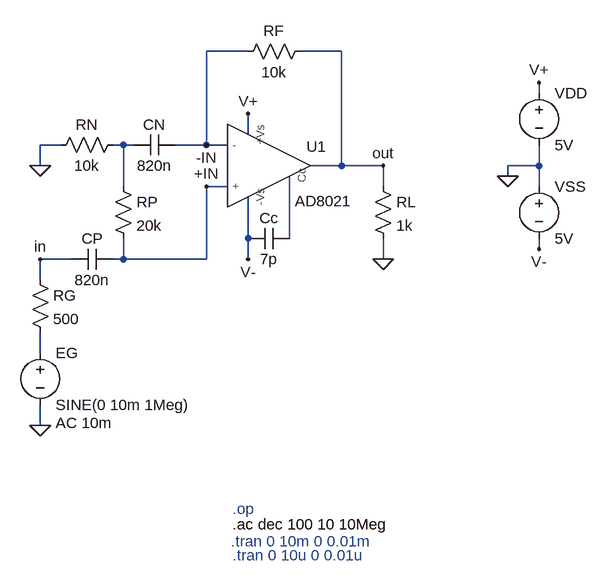
[diagram p0: schematic stage_1.asc]
stage_1.asc, the LTspice schematic file:
Version 4
SHEET 1 1116 792
WIRE 192 0 128 0
WIRE 336 0 272 0
WIRE 640 64 640 48
WIRE 192 128 192 96
WIRE -96 144 -128 144
WIRE 0 144 -16 144
WIRE 16 144 0 144
WIRE 128 144 128 0
WIRE 128 144 80 144
WIRE 160 144 128 144
WIRE -128 176 -128 144
WIRE 336 176 336 0
WIRE 336 176 288 176
WIRE 400 176 336 176
WIRE 640 176 640 144
WIRE 640 176 592 176
WIRE 592 192 592 176
WIRE 0 208 0 144
WIRE 160 208 128 208
WIRE 400 208 400 176
WIRE 640 208 640 176
WIRE 192 288 192 224
WIRE 256 288 256 192
WIRE 640 304 640 288
WIRE -80 320 -128 320
WIRE 0 320 0 288
WIRE 0 320 -16 320
WIRE 128 320 128 208
WIRE 128 320 0 320
WIRE 192 320 192 288
WIRE 400 320 400 288
WIRE -128 352 -128 320
WIRE -128 464 -128 432
WIRE -128 576 -128 544
FLAG 592 192 0
FLAG 640 48 V+
FLAG 192 96 V+
FLAG 192 320 V-
FLAG 640 304 V-
FLAG -128 320 in
FLAG -128 176 0
FLAG -128 576 0
FLAG 400 320 0
FLAG 400 176 out
FLAG 128 144 -IN
FLAG 128 208 +IN
SYMBOL AutoGenerated\\AD8021 224 176 R0
WINDOW 0 73 -14 Bottom 2
WINDOW 3 84 39 Top 2
SYMATTR InstName U1
SYMBOL voltage 640 48 R0
SYMATTR InstName VDD
SYMATTR Value 5V
SYMBOL voltage 640 192 R0
SYMATTR InstName VSS
SYMATTR Value 5V
SYMBOL cap 256 272 R90
WINDOW 0 0 32 VBottom 2
WINDOW 3 32 32 VTop 2
SYMATTR InstName Cc
SYMATTR Value 7p
SYMBOL res 288 -16 R90
WINDOW 0 0 56 VBottom 2
WINDOW 3 32 56 VTop 2
SYMATTR InstName RF
SYMATTR Value 10k
SYMBOL res 0 128 R90
WINDOW 0 0 56 VBottom 2
WINDOW 3 32 56 VTop 2
SYMATTR InstName RN
SYMATTR Value 10k
SYMBOL voltage -128 448 R0
WINDOW 123 24 124 Left 2
WINDOW 39 0 0 Left 0
SYMATTR InstName EG
SYMATTR Value SINE(0 10m 1Meg)
SYMATTR Value2 AC 10m
SYMBOL cap 80 128 R90
WINDOW 0 0 32 VBottom 2
WINDOW 3 32 32 VTop 2
SYMATTR InstName CN
SYMATTR Value 820n
SYMBOL res -16 192 R0
SYMATTR InstName RP
SYMATTR Value 20k
SYMBOL cap -16 304 R90
WINDOW 0 0 32 VBottom 2
WINDOW 3 32 32 VTop 2
SYMATTR InstName CP
SYMATTR Value 820n
SYMBOL res 384 192 R0
SYMATTR InstName RL
SYMATTR Value 1k
SYMBOL res -144 336 R0
SYMATTR InstName RG
SYMATTR Value 500
TEXT 166 754 Left 2 ;.tran 0 10m 0 0.01m
TEXT 168 728 Left 2 !.ac dec 100 10 10Meg
TEXT 168 704 Left 2 ;.op
TEXT 168 776 Left 2 ;.tran 0 10u 0 0.01u

The netlist it stands for:
* stage_1.asc
XU1 +IN -IN V+ V- out N002 AD8021  ; pins + - +Vs -Vs OUT Cc
VDD V+ 0 5V
VSS 0 V- 5V
Cc N002 V- 7p
RF out -IN 10k
RN N001 0 10k
V§EG N003 0 SINE(0 10m 1Meg) AC 10m
CN -IN N001 820n
RP N001 +IN 20k
CP +IN in 820n
RL out 0 1k
RG in N003 500
* .tran 0 10m 0 0.01m
.ac dec 100 10 10Meg
* .op
* .tran 0 10u 0 0.01u
.lib Z:\home\pesho\data\Electronics\asht-kr\simulations\ad8021.cir
.backanno
.end